# Altium project HW_RV_TOUCH_R1M1.PrjPcb (part 1 of 4)
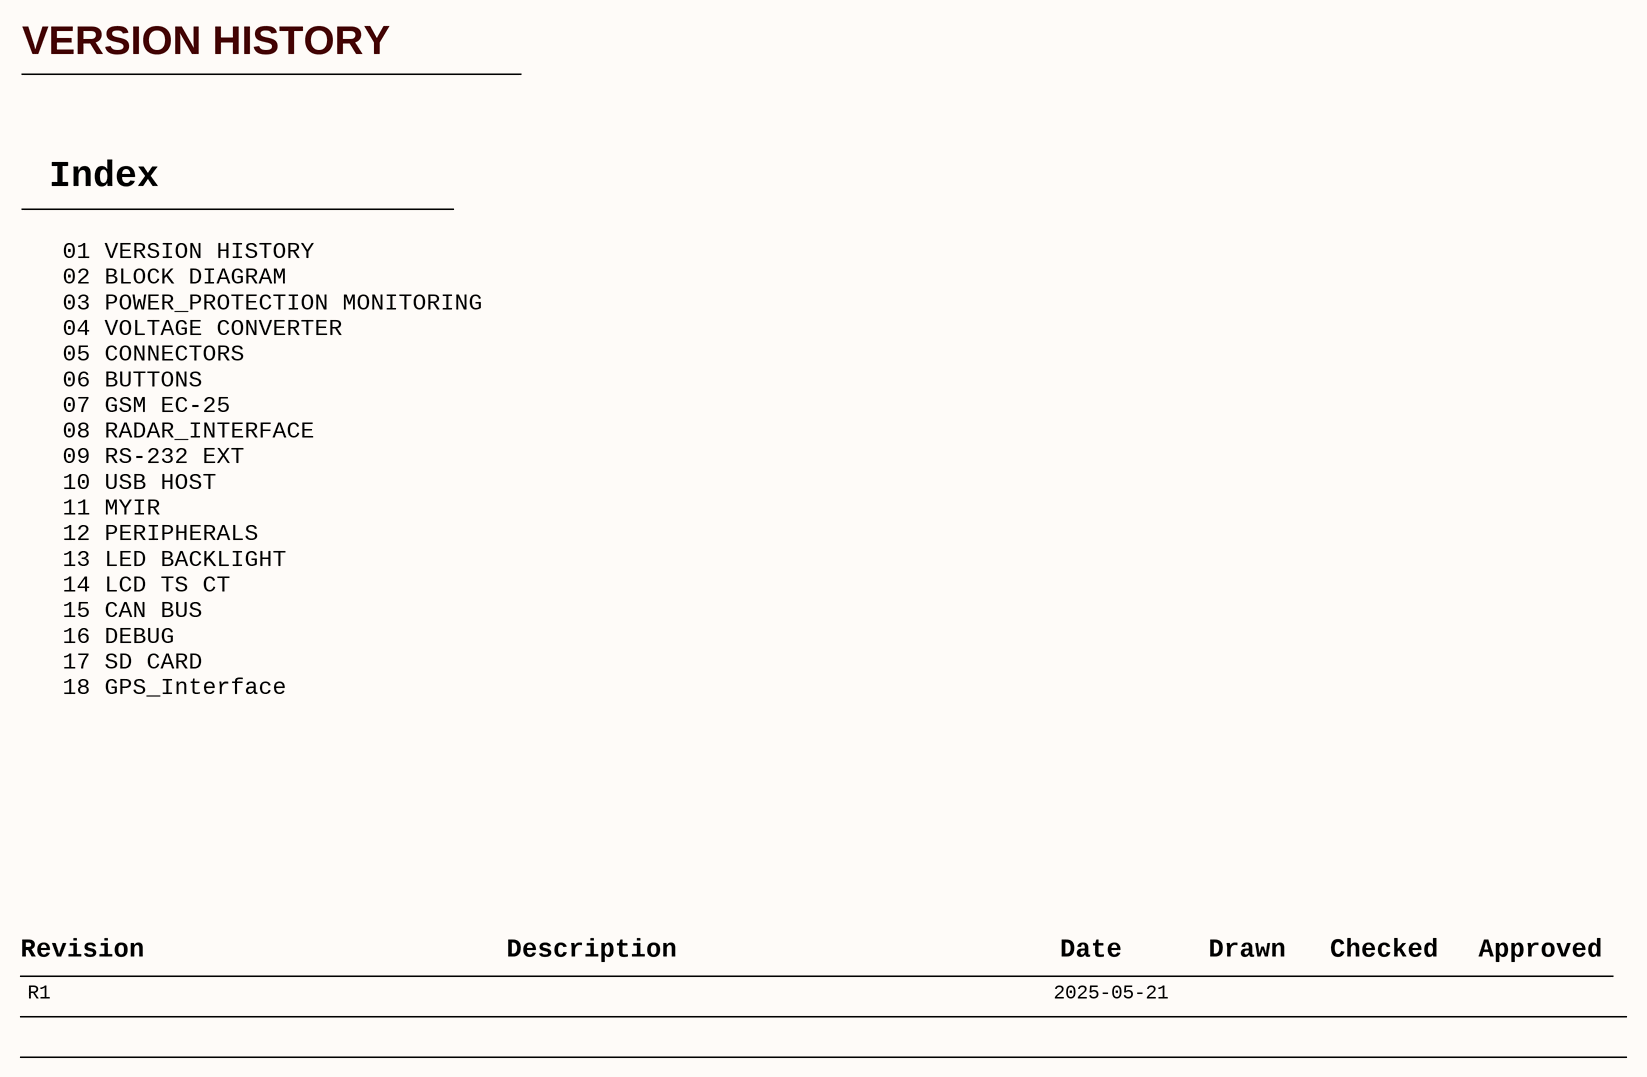
[diagram p0: 01_VERSION_HISTORY.SchDoc]
RevisionParameter: R1M1; TitleParameter: HW_RV_TOUCH
18 sheets, 341 parts. Net scope: flat (ports and power ports of the same name join across sheets).
Board file: HW_RV_TOUCH_R1M1.PcbDoc
Sheets:
  01_VERSION_HISTORY.SchDoc
  02_BLOCK_DIAGRAM.SchDoc
  03_POWER_PROTECTION_MONITORING.SchDoc
  04_VOLTAGE_CONVERTER.SchDoc
  05_CONNECTORS.SchDoc
  06_BUTTONS.SchDoc
  07_GSM_EM05.SchDoc
  08_RADAR_INTERFACE.SchDoc
  09_RS-232_EXT.SchDoc
  10_USB_HOST.SchDoc
  11_MYIR.SchDoc
  12_PERIPHERALS.SchDoc
  13_LED_BACKLIGHT.SchDoc
  14_LCD_TS_CT.SchDoc
  15_CAN_BUS.SchDoc
  16_DEBUG.SchDoc
  17_SD_CARD.SchDoc
  18_GPS_Interface.SchDoc

## Sheet 01_VERSION_HISTORY.SchDoc: =TitleParameter
size A3; Address: Crete IL; Organization: ASISGUARD; Address1: Kemalpasa, Kemalpasa Cd. No:290 D:292H, 35060 Bornova/Izmir/Turkey; Revision: R1M1

### Notes on the sheet
- VERSION HISTORY
- Index
- 01 VERSION HISTORY
  02 BLOCK DIAGRAM
  03 POWER_PROTECTION MONITORING
  04 VOLTAGE CONVERTER
  05 CONNECTORS
  06 BUTTONS
  07 GSM EC-25
  08 RADAR_INTERFACE
  09 RS-232 EXT
  10 USB HOST
  11 MYIR
  12 PERIPHERALS
  13 LED BACKLIGHT
  14 LCD TS CT
  15 CAN BUS
  16 DEBUG                                                                        17 SD CARD
  18 GPS_Interface
- Revision
- Description
- Date
- Drawn
- Checked
- Approved
- R1
- 2025-05-21
- Proje/Project:
- Sayfa Adı/Document Name:
- Çizilme Tarihi/Drawing Date
- Umit KAYACIK
- Tasarlayan/Designed By
- Sayfa/Sheet:
- Revision:
- of
- Son Güncelleme/Last Edit Date
- Kontrol eden/Checked By
- Onaylayan/Approved By
- Boyut/Size:
- Varyant/Variant:
- Dil/Language:
- A3
- ENG

## Sheet 02_BLOCK_DIAGRAM.SchDoc: =TitleParameter
size A3; Address: Crete IL; Organization: ASISGUARD; Address1: Kemalpasa, Kemalpasa Cd. No:290 D:292H, 35060 Bornova/Izmir/Turkey; Revision: R1M1
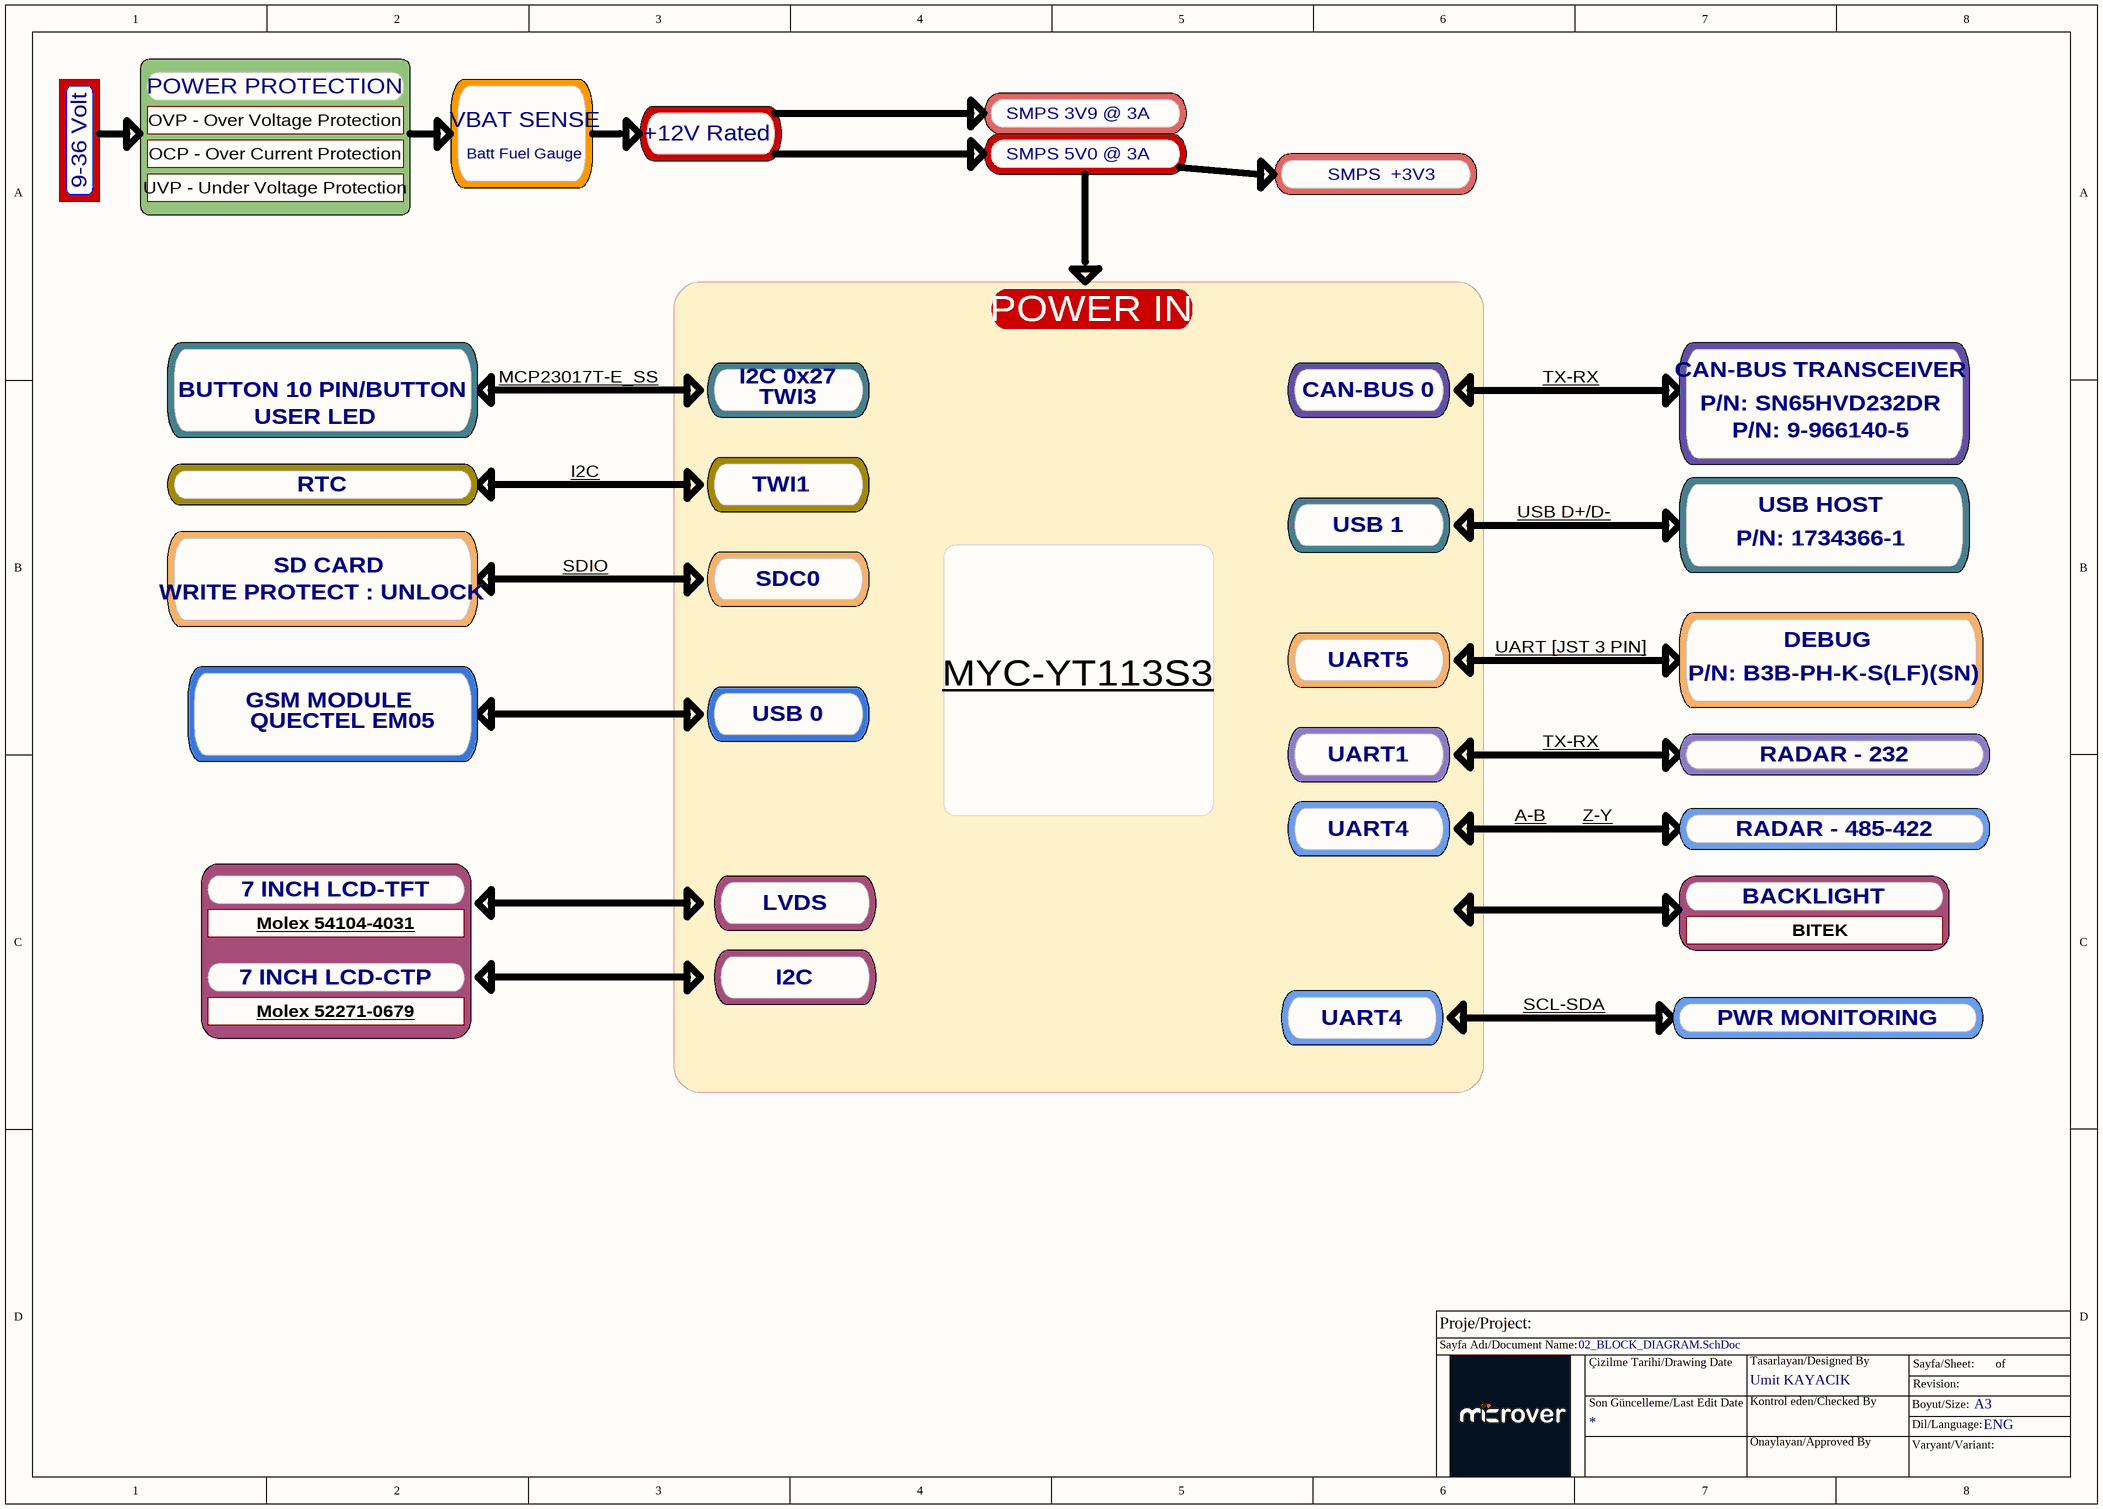
[diagram p1: 02_BLOCK_DIAGRAM.SchDoc]

### Notes on the sheet
- POWER PROTECTION
- SMPS 3V9 @ 3A
- 9-36 Volt
- OVP - Over Voltage Protection
- OCP - Over Current Protection
- UVP - Under Voltage Protection
- VBAT SENSE
- Batt Fuel Gauge
- +12V Rated
- SMPS 5V0 @ 3A
- SMPS  +3V3
- POWER IN
- MCP23017T-E_SS
- I2C 0x27
- TX-RX
- CAN-BUS TRANSCEIVER
- USER LED
- BUTTON 10 PIN/BUTTON
- TWI3
- CAN-BUS 0
- P/N: SN65HVD232DR
- P/N: 9-966140-5
- RTC
- I2C
- TWI1
- USB D+/D-
- USB HOST
- WRITE PROTECT : UNLOCK
- SD CARD
- SDIO
- SDC0
- USB 1
- P/N: 1734366-1
- UART [JST 3 PIN]
- DEBUG
- GSM MODULE
- QUECTEL EM05
- USB 0
- MYC-YT113S3 <https://www.myirtech.com/list.asp?id=722>
- UART5
- P/N: B3B-PH-K-S(LF)(SN)
- UART1
- RADAR - 232
- UART4
- A-B
- Z-Y
- RADAR - 485-422
- 7 INCH LCD-TFT
- Molex 54104-4031
- LVDS
- BACKLIGHT
- 7 INCH LCD-CTP
- BITEK
- Molex 52271-0679
- SCL-SDA
- PWR MONITORING
- Proje/Project:
- Sayfa Adı/Document Name:
- Çizilme Tarihi/Drawing Date
- Umit KAYACIK
- Tasarlayan/Designed By
- Sayfa/Sheet:
- Revision:
- of
- Son Güncelleme/Last Edit Date
- Kontrol eden/Checked By
- Onaylayan/Approved By
- Boyut/Size:
- Varyant/Variant:
- Dil/Language:
- A3
- ENG

## Sheet 03_POWER_PROTECTION_MONITORING.SchDoc: =TitleParameter
size A3; Address: Crete IL; Organization: ASISGUARD; Address1: Kemalpasa, Kemalpasa Cd. No:290 D:292H, 35060 Bornova/Izmir/Turkey; Revision: R1M1
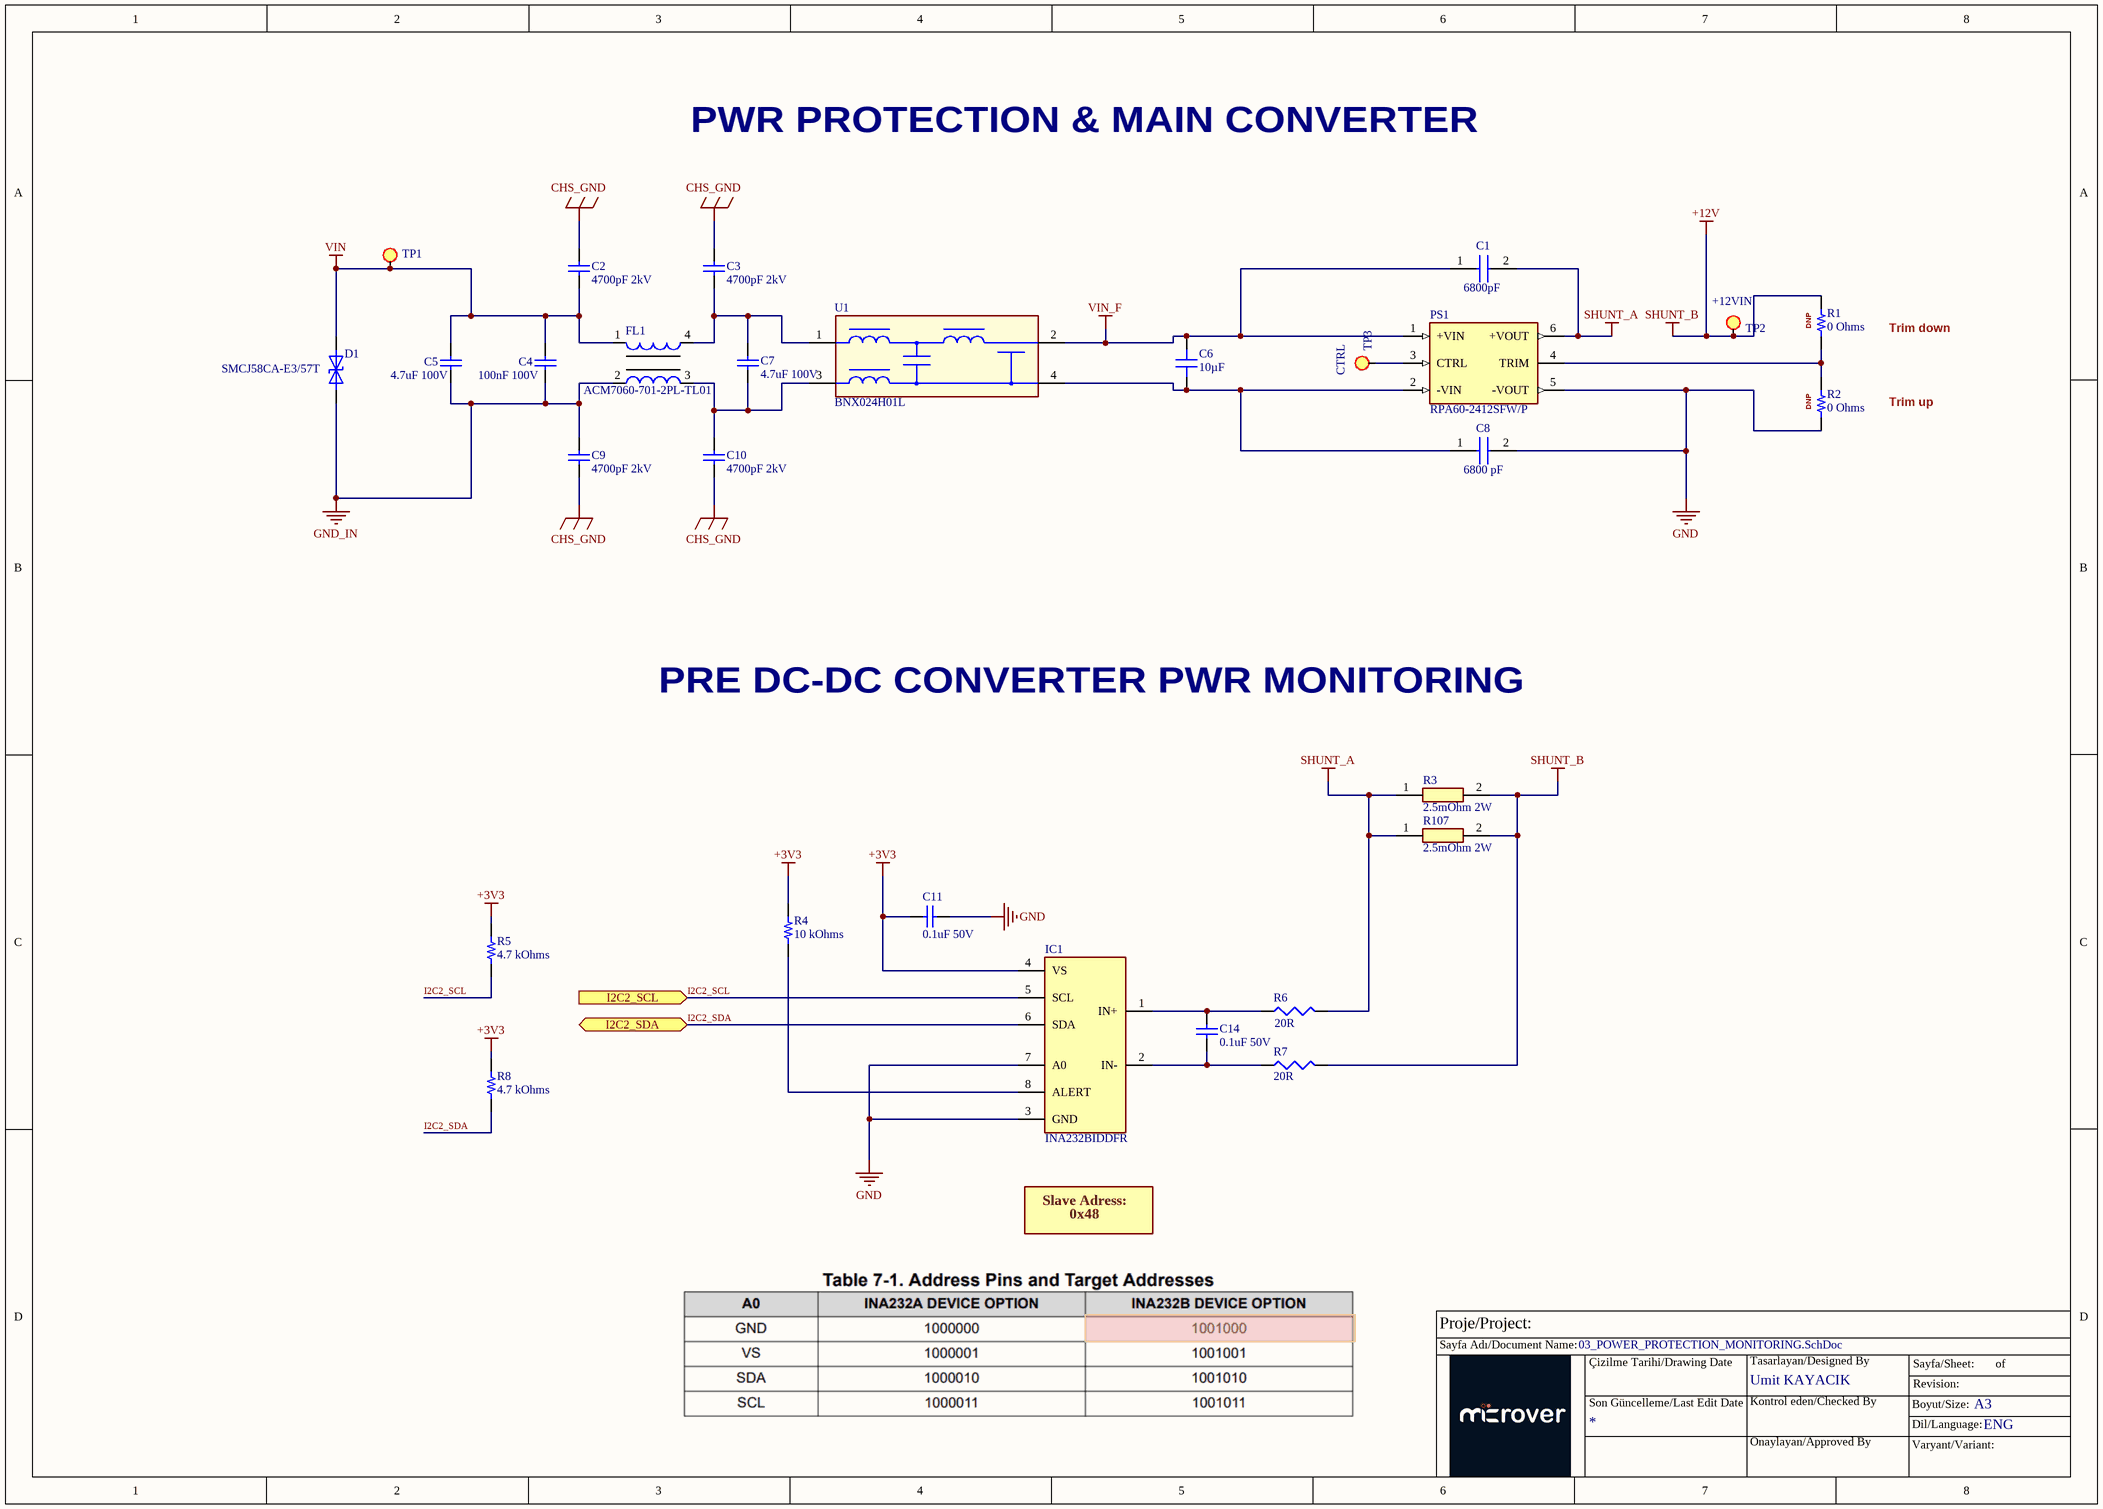
[diagram p2: 03_POWER_PROTECTION_MONITORING.SchDoc]

### Parts
C1  6800pF  [CAPC3225X280N]
C2  value 4700pF 2kV  [CAP1812]  (hidden comment: CAP CER 4700PF 2KV X7R 1812)
C3  value 4700pF 2kV  [CAP1812]  (hidden comment: CAP CER 4700PF 2KV X7R 1812)
C4  value 100nF 100V  [SMC0805]  (hidden comment: CAP CER 0.1UF 100V X7R 0805)
C5  value 4.7uF 100V  [CAP1210]  (hidden comment: CAP CER 4.7UF 100V X7S 1210)
C6  10µF  [CAP 1206_3216 - 1.8MM]
C7  value 4.7uF 100V  [CAP1210]  (hidden comment: CAP CER 4.7UF 100V X7S 1210)
C8  6800 pF  [CAPC3225X280N]
C9  value 4700pF 2kV  [CAP1812]  (hidden comment: CAP CER 4700PF 2KV X7R 1812)
C10  value 4700pF 2kV  [CAP1812]  (hidden comment: CAP CER 4700PF 2KV X7R 1812)
C11  value 0.1uF 50V  [SMC0603]  (hidden comment: CAP CER 0.1UF 50V X7R 0603)
C14  value 0.1uF 50V  [SMC0603]  (hidden comment: CAP CER 0.1UF 50V X7R 0603)
D1  SMCJ58CA-E3/57T  [DIOM7959X262N]
FL1  CMC 4A 2LN 700 OHM SMD  [TDK_0_MFG]  (value not drawn)
IC1  INA232BIDDFR  [SOT65P280X110-8N]
PS1  RPA60-2412SFW/P  [CONV_RPA60-2412SFW/P]
R1  0 Ohms  [RES 0402_1005]
R2  0 Ohms  [RES 0402_1005]
R3  2.5mOhm 2W  [RESC5125X89N]
R4  10 kOhms  [RES 0402_1005]
R5  4.7 kOhms  [RES 0603_1608]
R6  value 20R  [RES0603]  (hidden comment: RES 20 OHM 1% 1/10W 0603)
R7  value 20R  [RES0603]  (hidden comment: RES 20 OHM 1% 1/10W 0603)
R8  4.7 kOhms  [RES 0603_1608]
R107  2.5mOhm 2W  [RESC5125X89N]
TP1  VIN  [TEST_POINT_SMD]  (value not drawn)
TP2  +12VIN  [TEST_POINT_SMD]
TP3  CTRL  [TEST_POINT_SMD]
U1  FILTER LC 4.7UF SMD  [Murata_BNX02_MFG]  (value not drawn)

### Ports
I2C2_SCL (in), I2C2_SDA (bidir)

### Nets
+3V3: C11.1 IC1.4(VS) R4.2 R5.2 R8.2
+12V: R1.2 R3.2 R7.2 R107.2 TP2.1(TP)  [also labelled SHUNT_B]
CHS_GND: C2.2 C3.2 C9.1 C10.1
GND: C8.2 C11.2 IC1.3(GND) IC1.7(A0) PS1.5(-VOUT) R2.1
GND_IN: C4.1 C5.1 C9.2 D1.1 FL1.2
SHUNT_A: C1.2 PS1.6(+VOUT) R3.1 R6.2 R107.1
VIN: C2.1 C4.2 C5.2 D1.2 FL1.1 TP1.1(TP)
VIN_F: C1.1 C6.2 PS1.1(+VIN) U1.2(CB)
I2C2_SCL: IC1.5(SCL) R5.1 ; port I2C2_SCL
I2C2_SDA: IC1.6(SDA) R8.1 ; port I2C2_SDA
NetC3_1: C3.1 C7.2 FL1.4 U1.1(B)
NetC6_1: C6.1 C8.1 PS1.2(-VIN) U1.4(CG)
NetC7_1: C7.1 C10.2 FL1.3 U1.3(PSG)
NetC14_1: C14.1 IC1.2(IN-) R7.1
NetC14_2: C14.2 IC1.1(IN+) R6.1
NetIC1_8: IC1.8(ALERT) R4.1
NetPS1_3: PS1.3(CTRL) TP3.1(TP)
NetPS1_4: PS1.4(TRIM) R1.1 R2.2

### Notes on the sheet
- PWR PROTECTION & MAIN CONVERTER
- (near R1) DNP
- Trim down
- (near R2) DNP
- Trim up
- PRE DC-DC CONVERTER PWR MONITORING
- Slave Adress:
- 0x48
- Proje/Project:
- Sayfa Adı/Document Name:
- Çizilme Tarihi/Drawing Date
- Umit KAYACIK
- Tasarlayan/Designed By
- Sayfa/Sheet:
- Revision:
- of
- Son Güncelleme/Last Edit Date
- Kontrol eden/Checked By
- Onaylayan/Approved By
- Boyut/Size:
- Varyant/Variant:
- Dil/Language:
- A3
- ENG

### Library data of the parts
C1 = C1210C682MGRAC7800: CAP CER SMD 1210 6800PF 20% 2KV; Manufacturer_Name: KEMET; Datasheet Link: https://www.kemet.com/specsheet/C1210C682MGRACTU; Height: 2.8mm; Manufacturer_Part_Number: C1210C682MGRAC7800
C2 C3 C9 C10 = CAP1812_4700PF_2KV: 2kV 4.7nF X7R ±10% 1812 Multilayer Ceramic Capacitors MLCC - SMD/SMT ROHS; Manufacturer Part Number: 202S43W472KV4E; Order Code: *; Sirius Stock Code: *; LCSC Part Number: C167436; LCSC Manufacturer Part Number: 202S43W472KV4E
C4 = CAP0805_100nF_100V: 0.1 µF ±10% 100V Ceramic Capacitor X7R 0805 (2012 Metric); Manufacturer Part Number: CL21B104KCFNNNE; Order Code: DIGI : 1276-6840-1-ND; LCSC Manufacturer Part Number: CL21B104KCFNNNE; LCSC Part Number: C28233
C5 C7 = CAP1210_4.7UF_100V: 4.7 µF ±10% 100V Ceramic Capacitor X7S 1210 (3225 Metric); Manufacturer Part Number: CL32Y475KCIVPNE; Order Code: Digi: 1276-CL32Y475KCIVPNETR-ND; LCSC Manufacturer Part Number: CL32Y475KCIVPNE; LCSC Part Number: C2803397
C6 = 12065D106KAT2A: CAP CER 10UF 50V X5R 1206; manufacturer: AVX Corporation; Tolerance: ±10%; Part Number: 12065D106KAT2A; Value: 10µF; Applications: General Purpose; Capacitance: 10µF; componentlink1description: Datasheet; componentlink1url: http://datasheets.avx.com/cx5r.pdf; componentlink2description: DigiKey Link; componentlink2url: http://digikey.com/product-detail/en/avx-corporation/12065D106KAT2A/478-9979-1-ND/6149060; Device Package: 1206 (3216 Metric); lastupdated: 9/2/2020 1:05:35 AM; Lifecycle Status: Active; Minimum Order: 1; Mounting Type: Surface Mount, MLCC; Operating Temperature: -55°C ~ 85°C; Package / Case: 1206 (3216 Metric); packaging: TapeAndReel; partid: 21345; Part Status: Active; price: 0.16; series: -; Size / Dimension: 0.126" L x 0.063" W (3.20mm x 1.60mm); Supplier 1: DigiKey; Supplier Part Number 1: 478-9979-1-ND; Temperature Coefficient: X5R; Thickness (Max): 0.071" (1.80mm); Voltage - Rated: 50V
C8 = C1210C682MGRAC7800: Capacitor; Manufacturer_Name: KEMET; Datasheet Link: https://www.kemet.com/specsheet/C1210C682MGRACTU; Height: 2.8mm; Manufacturer_Part_Number: C1210C682MGRAC7800
C11 C14 = CAP0603_0.1UF_50V: 0.1 µF ±10% 50V Ceramic Capacitor X7R 0603 (1608 Metric); Manufacturer Part Number: CL10B104KB8NNNL; LCSC Manufacturer Part Number: CL10B104KB8NNNC; Order Code: DIGI:1276-CL10B104KB8NNNLTR-ND; Sirius Stock Code: A063-AGC10300001226; LCSC Part Number: C1591
D1 = SMCJ58CA-E3/57T: TransZorb 1500 W 58 V 93.6 Vcl Bi-Directional SMT TVS Diode - DO-214AB; Manufacturer: Vishay Semiconductors; Supplier 1: Digikey; Manufacturer Part Number: SMCJ58CA-E3/57T; RoHS: Yes; Category: TVS Diodes; Stock 1: 1611; Pricing 1: 1=0.64, 10=0.545, 100=0.3792 (USD); ComponentLink1URL: https://datasheet.ciiva.com/4247/smcj50a-4247736.pdf?src-supplier=Arrow+Electronics; ComponentLink1Description: https://datasheet.ciiva.com/4247/smcj50a-4247736.pdf?src-supplier=Arrow+Electronics; ComponentLink2URL: https://datasheet.ciiva.com/340/smcj50a-340997.pdf?src-supplier=Digikey; ComponentLink2Description: https://datasheet.ciiva.com/340/smcj50a-340997.pdf?src-supplier=Digikey; ComponentLink3URL: https://datasheet.ciiva.com/340/smcj50a-340998.pdf?src-supplier=Digikey; ComponentLink3Description: https://datasheet.ciiva.com/340/smcj50a-340998.pdf?src-supplier=Digikey; ComponentLink4URL: https://datasheet.ciiva.com/340/smcj50a-340999.pdf?src-supplier=Digikey; ComponentLink4Description: https://datasheet.ciiva.com/340/smcj50a-340999.pdf?src-supplier=Digikey; ComponentLink5URL: https://datasheet.ciiva.com/4508/smcj50a-241829-4508847.pdf?src-supplier=Mouser; ComponentLink5Description: https://datasheet.ciiva.com/4508/smcj50a-241829-4508847.pdf?src-supplier=Mouser; Supplier Part Number 1: SMCJ58CA-E3/57TGICT-ND
FL1 = ACM7060-701-2PL-TL01: 2 Line Common Mode Choke Surface Mount 700 Ohms @ 100 MHz 4A DCR 15mOhm; Order Code: Digi: 445-2215-2-ND; LCSC Manufacturer Part Number: ACM7060-701-2PL-TL01; LCSC Part Number: C78246; Manufacturer Part Number: ACM7060-701-2PL-TL01
IC1 = INA232BIDDFR: 48-V, 16-bit high-precision I²C output digital power monitor with alert 8-SOT-23-THIN -40 to 125; Manufacturer: Texas Instruments; Supplier 1: Digikey; Manufacturer Part Number: INA232BIDDFR; RoHS: No; Stock 1: 8755; Pricing 1: 1=2.5, 10=2.248, 25=2.1208, 100=1.8071, 250=1.6968, 500=1.4847, 1000=1.23018 (USD); Supplier Part Number 1: 296-INA232BIDDFRCT-ND
PS1 = RPA60-2412SFW/P: 60W DC/DC-Converter 'POWERLINE' 2 x1 1.5kV reg 4: ; V. In: 9-36; V. Out: 12; mA. Out: 5000; Manufacturer: Recom; Supplier 1: Digikey; Manufacturer Part Number: RPA60-2412SFW/P; RoHS: Yes; Category: Board Mount Modules; Stock 1: 3612; Pricing 1: 1=68.75, 5=66.14, 10=65.618, 25=63.5352, 50=60.4106, 100=56.2444 (USD); ComponentLink1URL: https://datasheet.octopart.com/RPA60-2412SFW-P-Recom-Power-datasheet-67314772.pdf?src-supplier=Newark; ComponentLink1Description: https://datasheet.octopart.com/RPA60-2412SFW-P-Recom-Power-datasheet-67314772.pdf?src-supplier=Newark; ComponentLink2URL: https://www.recom-power.com/pdf/Powerline-DC-DC/RPA60-FW.pdf?src-supplier=Digikey; ComponentLink2Description: https://www.recom-power.com/pdf/Powerline-DC-DC/RPA60-FW.pdf?src-supplier=Digikey; ComponentLink3URL: https://datasheet.octopart.com/RPA60-2412SFW-P-Recom-Power-datasheet-68305293.pdf?src-supplier=Sager+Electronics; ComponentLink3Description: https://datasheet.octopart.com/RPA60-2412SFW-P-Recom-Power-datasheet-68305293.pdf?src-supplier=Sager+Electronics; Supplier Part Number 1: 945-2958-ND
R1 R2 = HCJ0402ZT0R00: RES 0 OHM JUMPER 1/8W 0402; Manufacturer: Stackpole Electronics Inc; Power (Watts): 0.125W, 1/8W; Part Number: HCJ0402ZT0R00; Value: 0 Ohms; ComponentLink1Description: Datasheet; ComponentLink1URL: https://www.seielect.com/catalog/sei-hcj.pdf; ComponentLink2Description: DigiKey Link; ComponentLink2URL: https://www.digikey.com/en/products/detail/stackpole-electronics-inc/HCJ0402ZT0R00/4357659; Composition: Metal Foil; Device Package: 0402 (1005 Metric); Features: Automotive AEC-Q200; Height - Seated (Max): 0.018" (0.45mm); LastUpdated: 2/9/2024 8:29:49 PM; Lifecycle Status: Active; Minimum Order: 1; Number of Terminations: 2; Operating Temperature: -55°C ~ 155°C; Package / Case: 0402 (1005 Metric); Packaging: TapeAndReel; PartId: 12327; Part Status: Active; Price: 0.07; Ratings: AEC-Q200; Resistance: 0 Ohms; Series: HCJ; Size / Dimension: 0.039" L x 0.020" W (1.00mm x 0.50mm); Supplier 1: DigiKey; Supplier Part Number 1: HCJ0402ZT0R00CT-ND; Supplier Device Package: 0402; Tolerance: Jumper
R3 R107 = WSLP20102L500FEA: Resistor; Manufacturer_Name: Vishay; Datasheet Link: https://www.vishay.com/doc?30122; Height: 0.889mm; Manufacturer_Part_Number: WSLP20102L500FEA; Mouser Part Number: N/A; Mouser Price/Stock: https://www.mouser.co.uk/ProductDetail/Vishay-Dale/WSLP20102L500FEA?qs=%2FCXICPRLKg%252BjdjH3wDEueQ%3D%3D
R4 = RP73PF1E10KBTD: RES 10K OHM 0.1% 1/10W 0402; Manufacturer: TE Connectivity Passive Product; Power (Watts): 0.1W, 1/10W; Temperature Coefficient: ±25ppm/°C; Part Number: RP73PF1E10KBTD; Value: 10 kOhms; ComponentLink1Description: Datasheet; ComponentLink1URL: https://www.te.com/commerce/DocumentDelivery/DDEController?Action=srchrtrv&DocNm=1773272&DocType=DS&DocLang=English; ComponentLink2Description: DigiKey Link; ComponentLink2URL: https://www.digikey.com/en/products/detail/te-connectivity-passive-product/RP73PF1E10KBTD/8260957; Composition: Thin Film; Device Package: 0402 (1005 Metric); Height - Seated (Max): 0.014" (0.35mm); LastUpdated: 2/9/2024 8:30:24 PM; Lifecycle Status: Active; Minimum Order: 1; Number of Terminations: 2; Operating Temperature: -55°C ~ 155°C; Package / Case: 0402 (1005 Metric); Packaging: TapeAndReel; PartId: 2434; Part Status: Active; Price: 0.08; Resistance: 10 kOhms; Series: RP73, Holsworthy; Size / Dimension: 0.039" L x 0.020" W (1.00mm x 0.50mm); Supplier 1: DigiKey; Supplier Part Number 1: A127415CT-ND; Supplier Device Package: 0402; Tolerance: ±0.1%
R5 R8 = RN73R1JTTD4701B25: RES 4.7K OHM 0.1% 1/10W 0603; Manufacturer: KOA Speer Electronics, Inc.; Power (Watts): 0.1W, 1/10W; Temperature Coefficient: ±25ppm/°C; Part Number: RN73R1JTTD4701B25; Value: 4.7 kOhms; ComponentLink1Description: Datasheet; ComponentLink1URL: //media.digikey.com/pdf/Data%20Sheets/KOA%20Speer/RN73R_Type_DS.pdf; ComponentLink2Description: DigiKey Link; ComponentLink2URL: https://www.digikey.com/en/products/detail/koa-speer-electronics-inc/RN73R1JTTD4701B25/9991881; Composition: Thin Film; Device Package: 0603 (1608 Metric); Features: Automotive AEC-Q200, Moisture Resistant; Height - Seated (Max): 0.022" (0.55mm); LastUpdated: 2/9/2024 8:43:22 PM; Lifecycle Status: Active; Minimum Order: 1; Number of Terminations: 2; Operating Temperature: -55°C ~ 155°C; Package / Case: 0603 (1608 Metric); Packaging: TapeAndReel; PartId: 8410; Part Status: Active; Price: 0.05; Ratings: AEC-Q200; Resistance: 4.7 kOhms; Series: RN73R; Size / Dimension: 0.063" L x 0.031" W (1.60mm x 0.80mm); Supplier 1: DigiKey; Supplier Part Number 1: 2019-RN73R1JTTD4701B25CT-ND; Supplier Device Package: 0603; Tolerance: ±0.1%
R6 R7 = RES0603_20R_%1: 20 Ohms ±1% 0.1W, 1/10W Chip Resistor 0603 (1608 Metric) Automotive AEC-Q200 Thick Film; Manufacturer Part Number: RMCF0603FT20R0; LCSC Manufacturer Part Number: WR06X20R0FTL; Order Code: Digi: RMCF0603FT20R0TR-ND; Sirius Stock Code: *; LCSC Part Number: C163881
TP1-TP3 = TP: DESIG: testing PAD; FAB: NA; VAL: NOT POPULATED; PCB Footprint: test0_8-smd; REF: NA
U1 = BNX024H01L: LC EMI Filter 5th Order Low Pass 2 Channel C = 4.7µF 20 A 4-SMD, No Lead; Order Code: Digi: 490-7833-2-ND; LCSC Manufacturer Part Number: BNX024H01L; LCSC Part Number: C124739; Manufacturer Part Number: BNX024H01L

## Sheet 04_VOLTAGE_CONVERTER.SchDoc: =TitleParameter
size A3; Address: Crete IL; Organization: ASISGUARD; Address1: Kemalpasa, Kemalpasa Cd. No:290 D:292H, 35060 Bornova/Izmir/Turkey; Revision: R1M1
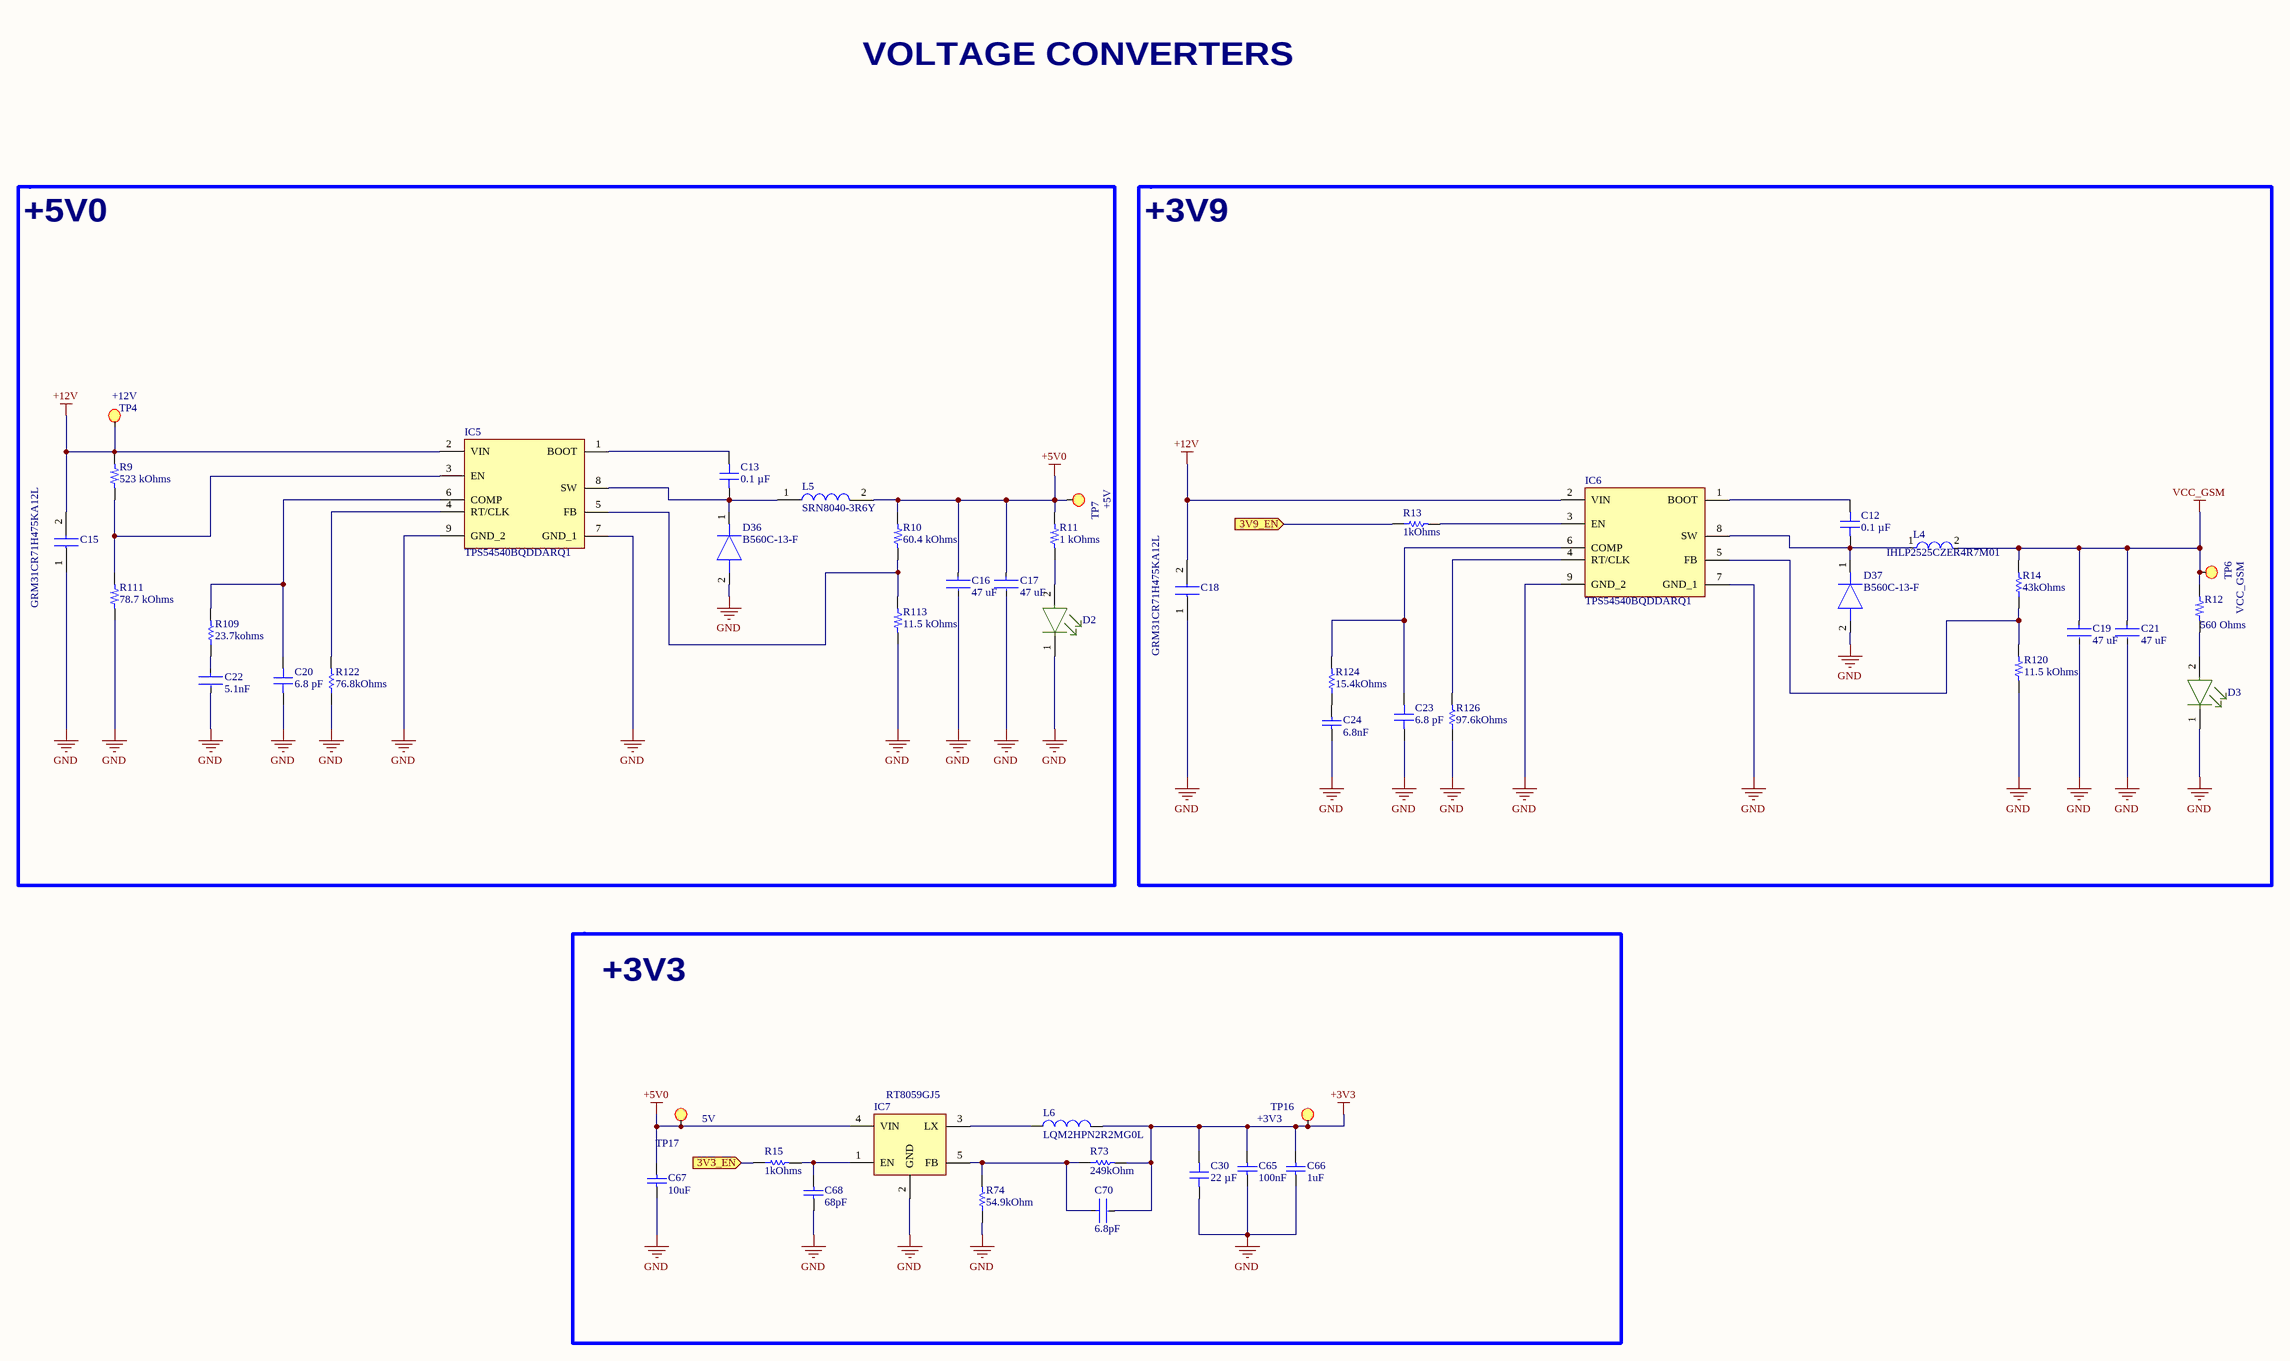
[diagram p3: 04_VOLTAGE_CONVERTER.SchDoc]

### Parts
C12  0.1 µF  [CAP0402(1005)X0.5]
C13  0.1 µF  [CAP0402(1005)X0.5]
C15  GRM31CR71H475KA12L  [CAPC3216X180N]
C16  47 uF  [FP-GRM32E-0_3-0_2-IPC_C]
C17  47 uF  [FP-GRM32E-0_3-0_2-IPC_C]
C18  GRM31CR71H475KA12L  [CAPC3216X180N]
C19  47 uF  [FP-GRM32E-0_3-0_2-IPC_C]
C20  6.8 pF  [CAP0603]
C21  47 uF  [FP-GRM32E-0_3-0_2-IPC_C]
C22  5.1nF  [FP-C0603C-CF-MFG]
C23  6.8 pF  [CAP0603]
C24  6.8nF  [CAPC1608X90X35NL10T15]
C30  22 µF  [CAP1206]
C65  100nF  [CAP0603]
C66  1uF  [CAP0603]
C67  10uF  [CAP0603]
C68  68pF  [CAP0603]
C70  6.8pF  [FP-C0603C-CF-MFG]
D2  LED GREEN CLEAR SMD  [Lite-On_GREEN_MFG]  (value not drawn)
D3  LED GREEN CLEAR SMD  [Lite-On_GREEN_MFG]  (value not drawn)
D36  B560C-13-F  [DIOM7959X250N]
D37  B560C-13-F  [DIOM7959X250N]
IC5  TPS54540BQDDARQ1  [SOIC127P600X170-9N]
IC6  TPS54540BQDDARQ1  [SOIC127P600X170-9N]
IC7  RT8059GJ5  [SOT94P280X100-5N]
L4  IHLP2525CZER4R7M01  [FP-IHLP-2525CZ-FP_2_413x3-MFG]
L5  SRN8040-3R6Y  [SRN8040-3R3Y]
L6  LQM2HPN2R2MG0L  [INDC2520X100N]
R9  523 kOhms  [RES0402(1005)]
R10  60.4 kOhms  [RES0402(1005)]
R11  1 kOhms  [RES 0603_1608]
R12  560 Ohms  [RES 0402_1005]
R13  1kOhms  [RESC1005X40X25LL05T10]
R14  43kOhms  [RESC1005X40X25NL05T05]
R15  1kOhms  [RESC1005X40X25LL05T10]
R73  249kOhm  [RESC1005X40X25NL05T05]
R74  54.9kOhm  [RESC1005X40X25LL05T10]
R109  23.7kohms  [RESC1005X40X25ML05T05]
R111  78.7 kOhms  [RES0402(1005)]
R113  11.5 kOhms  [RES0402(1005)]
R120  11.5 kOhms  [RES0402(1005)]
R122  76.8kOhms  [RESC1609X50X30ML10T20]
R124  15.4kOhms  [RESC1005X40X25ML05T05]
R126  97.6kOhms  [RESC1005X40X25ML05T10]
TP4  +12V  [TEST_POINT_SMD]
TP6  VCC_GSM  [TEST_POINT_SMD]
TP7  +5V  [TEST_POINT_SMD]
TP16  +3V3  [TEST_POINT_SMD]
TP17  5V  [TEST_POINT_SMD]

### Blocks framed on the sheet
+5V0: C13 C15-C17 C20 C22 D2 D36 IC5 L5 R9-R11 R109 R111 R113 R122 TP4 TP7
+3V9: C12 C18 C19 C21 C23 C24 D3 D37 IC6 L4 R12-R14 R120 R124 R126 TP6
+3V3: C30 C65-C68 C70 IC7 L6 R15 R73 R74 TP16 TP17

### Ports
3V3_EN (in), 3V9_EN (in)

### Nets
+3V3: C30.2 C65.2 C66.2 C70.2 L6.2 R73.2 TP16.1(TP)
+5V0: C16.1 C17.1 C67.1 IC7.4(VIN) L5.2 R10.2 R11.2 TP7.1(TP) TP17.1(TP)
+12V: C15.2 C18.2 IC5.2(VIN) IC6.2(VIN) R9.2 TP4.1(TP)
GND: C15.1 C16.2 C17.2 C18.1 C19.2 C20.1 C21.2 C22.2 C23.1 C24.1 C30.1 C65.1 C66.1 C67.2 C68.2 D2.1(C) D3.1(C) D36.2(A) D37.2(A) IC5.7(GND_1) IC5.9(GND_2) IC6.7(GND_1) IC6.9(GND_2) IC7.2(GND) R74.1 R111.1 R113.1 R120.1 R122.1 R126.1
VCC_GSM: C19.1 C21.1 L4.2 R12.2 R14.2 TP6.1(TP)
NetC12_1: C12.1 D37.1(K) IC6.8(SW) L4.1
NetC12_2: C12.2 IC6.1(BOOT)
NetC13_1: C13.1 D36.1(K) IC5.8(SW) L5.1
NetC13_2: C13.2 IC5.1(BOOT)
NetC20_2: C20.2 IC5.6(COMP) R109.2
NetC22_1: C22.1 R109.1
NetC23_2: C23.2 IC6.6(COMP) R124.2
NetC24_2: C24.2 R124.1
NetC68_1: C68.1 IC7.1(EN) R15.2
NetC70_1: C70.1 IC7.5(FB) R73.1 R74.2
NetD2_2: D2.2(A) R11.1
NetD3_2: D3.2(A) R12.1
NetIC5_3: IC5.3(EN) R9.1 R111.2
NetIC5_4: IC5.4(RT/CLK) R122.2
NetIC5_5: IC5.5(FB) R10.1 R113.2
NetIC6_3: IC6.3(EN) R13.2
NetIC6_4: IC6.4(RT/CLK) R126.2
NetIC6_5: IC6.5(FB) R14.1 R120.2
NetIC7_3: IC7.3(LX) L6.1
NetR13_1: R13.1 ; port 3V9_EN
NetR15_1: R15.1 ; port 3V3_EN

### Notes on the sheet
- VOLTAGE CONVERTERS
- Proje/Project:
- Sayfa Adı/Document Name:
- Çizilme Tarihi/Drawing Date
- Umit KAYACIK
- Tasarlayan/Designed By
- Sayfa/Sheet:
- Revision:
- of
- Son Güncelleme/Last Edit Date
- Kontrol eden/Checked By
- Onaylayan/Approved By
- Boyut/Size:
- Varyant/Variant:
- Dil/Language:
- A3
- ENG

### Library data of the parts
C12 C13 = C0402C104K4RECAUTO: CAP CER 0402 0.1UF 16V X7R 10%; manufacturer: KEMET; Part Number: C0402C104K4RECAUTO; Value: 0.1 µF; Applications: Automotive, ESD Protection; Capacitance: 0.1 µF; componentlink1description: Datasheet; componentlink1url: https://api.kemet.com/component-edge/download/datasheet/C0402C104K4RECAUTO.pdf; componentlink2description: DigiKey Link; componentlink2url: https://www.digikey.com/en/products/detail/kemet/C0402C104K4RECAUTO/8563695; Device Package: 0402 (1005 Metric); lastupdated: 2/9/2024 8:04:38 PM; Lifecycle Status: Active; Minimum Order: 1; Mounting Type: Surface Mount, MLCC; Operating Temperature: -55°C ~ 125°C; Package / Case: 0402 (1005 Metric); packaging: TapeAndReel; partid: 1731; Part Status: Active; price: 0.01; Ratings: AEC-Q200; series: ESD SMD Auto X7R; Size / Dimension: 0.039" L x 0.020" W (1.00mm x 0.50mm); Supplier 1: DigiKey; Supplier Part Number 1: 399-17167-1-ND; Temperature Coefficient: X7R; Thickness (Max): 0.022" (0.55mm); Tolerance: ±10%; Voltage - Rated: 16V
C15 C18 = GRM31CR71H475KA12L: Capacitor; Manufacturer_Name: Murata Electronics; Datasheet Link: https://search.murata.co.jp/Ceramy/image/img/A01X/G101/ENG/GRM31CR71H475KA12-01A.pdf; Height: 1.8mm; Manufacturer_Part_Number: GRM31CR71H475KA12L; Mouser Part Number: 81-GRM31CR71H475KA2L; Mouser Price/Stock: https://www.mouser.co.uk/ProductDetail/Murata-Electronics/GRM31CR71H475KA12L?qs=QOxk%252BkhTc6I%252BVQUsJuOHog%3D%3D; Arrow Part Number: GRM31CR71H475KA12L; Arrow Price/Stock: https://www.arrow.com/en/products/grm31cr71h475ka12l/murata-manufacturing?utm_currency=USD&region=nac
C16 C17 C19 C21 = CMP-2000-06362-2: CAP CER 47UF 16V X5R 1210; Part Number: GRM32ER61C476KE15L; Tolerance: 10%; Material: Ceramic; Case Code (Metric): 3225; RoHS Compliant: Yes; Min Operating Temperature: -55°C; Radiation Hardening: No; Voltage: 16V; Package Quantity: 1; Case Code (Imperial): 1210; REACH SVHC: No SVHC; Capacitance: 47uF; Voltage Rating (DC): 16V; Dielectric: X5R; Case/Package: 1210; Length: 3.2mm; Voltage Rating: 16V; Packaging: Cut Tape; Width: 0.098inch; Number of Pins: 2; Lead Free: Lead Free; Height: 2.5mm; Mount: Surface Mount; Termination: SMD/SMT; Max Operating Temperature: 85°C; Thickness: 0.106inch; Depth: 2.5mm
C20 C23 = 06031U6R8BAT2A: CAP CER 6.8PF 100V NP0 0603; manufacturer: KYOCERA AVX; Temperature Coefficient: C0G, NP0; Tolerance: ±0.1pF; Part Number: 06031U6R8BAT2A; Value: 6.8 pF; Applications: RF, Microwave, High Frequency; Capacitance: 6.8 pF; componentlink1description: Datasheet; componentlink1url: https://datasheets.kyocera-avx.com/U-Series.pdf; componentlink2description: DigiKey Link; componentlink2url: https://www.digikey.com/en/products/detail/kyocera-avx/06031U6R8BAT2A/1598953; Device Package: 0603 (1608 Metric); Features: Ultra Low ESR; lastupdated: 2/9/2024 8:09:59 PM; Lifecycle Status: Active; Minimum Order: 1; Mounting Type: Surface Mount, MLCC; Operating Temperature: -55°C ~ 125°C; Package / Case: 0603 (1608 Metric); packaging: TapeAndReel; partid: 35837; Part Status: Active; price: 0.05; series: U; Size / Dimension: 0.060" L x 0.030" W (1.52mm x 0.76mm); Supplier 1: DigiKey; Supplier Part Number 1: 478-06031U6R8BAT2ACT-ND; Thickness (Max): 0.036" (0.91mm); Voltage - Rated: 100V
C22 = CMP-1035-02216-3: CAP CER 5100PF 50V C0G/NP0 0603; Manufacturer: KEMET; Manufacturer Part Number: C0603C512J5GACTU; Tolerance: 0.05; Material: Ceramic; Value: 5,100 pF; Temperature Characteristic: C0G; Temperature Coefficient: 30ppm/°C; Automotive Grade: Grade 1; Mouser Description: Multilayer Ceramic Capacitors MLCC - SMD/SMT 50volts 5100pF 5% C0G; Lead Free: Yes; Digikey Description: CAP CER 5100PF 50V C0G/NP0 0603; ComponentLink2URL: https://api.kemet.com/component-edge/download/datasheet/C0603C100J5GACAUTO.pdf; Octopart: https://octopart.com/c0603c512j5gactu-kemet-19757382; Device Class L2: Capacitors; Automotive: Yes; ComponentLink2Description: Datasheet; Voltage Rating: 50 V; Temperature Range High: +125°C; Temperature Range Low: -55°C; RoHS: TRUE; Capacitance: 5,100 pF; Temperature: -55°C to +125°C; Package: C0603C-CF; Device Class L1: Passive Components; Height: 0.87mm; Device Class L3: Ceramic Capacitors; Category: Cap; Part Number: C0603C512J5GACTU
C24 = CMP-2006-02958-1: Part Number: GRM188R72A682KA01D; Manufacturer: Murata
C30 = CL31A226KAHNNNE: CAP CER 22UF 25V X5R 1206; manufacturer: Samsung Electro-Mechanics; Tolerance: ±10%; Part Number: CL31A226KAHNNNE; Value: 22 µF; Applications: General Purpose; Capacitance: 22 µF; componentlink1description: Datasheet; componentlink1url: http://www.samsungsem.com/kr/support/product-search/mlcc/CL31A226KAHNNNE.jsp; componentlink2description: DigiKey Link; componentlink2url: https://www.digikey.com/en/products/detail/samsung-electro-mechanics/CL31A226KAHNNNE/3888705; Device Package: 1206 (3216 Metric); lastupdated: 3/11/2024 7:11:00 AM; Lifecycle Status: Active; Minimum Order: 1; Mounting Type: Surface Mount, MLCC; Operating Temperature: -55°C ~ 85°C; Package / Case: 1206 (3216 Metric); packaging: TapeAndReel; partid: 22185; Part Status: Active; price: 0.07; series: CL; Size / Dimension: 0.126" L x 0.063" W (3.20mm x 1.60mm); Supplier 1: DigiKey; Supplier Part Number 1: 1276-3047-1-ND; Temperature Coefficient: X5R; Thickness (Max): 0.071" (1.80mm); Voltage - Rated: 25V
C65 = CAP0603_100nF: CAP CER 0.1UF 50V X7R 0603; Part Number: C0603C104K5RACTU; Value: 100nF 50V; Order Code: DIGI : 399-5089-1-ND
C66 = CAP0603_100nF: CAP CER 1uF 25V X7R 0603; Part Number: CGA3E1X7R1E105K080AE; Value: 1uF 25V; Order Code: DIGI : 445-173628-2-ND
C67 = CAP0603_100nF: Ceramic Capacitor,10uF,16V,+/-20%,X5R,0603,Samsung; P/N: CL10A106MONQNC; Value: 10uF 16V
C68 = CAP0603_100nF: 68 pF ±2% 50V Ceramic Capacitor C0G, NP0 0603 (1608 Metric); Part Number: 06035A680GAT2A; Value: 68pF 50V; Order Code: DIGI : 478-10332-2-ND
C70 = CMP-2006-03271-2: CAP CER 6.8PF 50V NP0 0603; Manufacturer Part Number: C0603C689C5GACTU; Manufacturer: KEMET; Automotive Grade: Grade 1; Temperature Coefficient: 30ppm/°C; Temperature Characteristic: C0G; Tolerance: 0.25 pF; Material: Ceramic; ComponentLink2URL: https://api.kemet.com/component-edge/download/datasheet/C0603C100J5GACAUTO.pdf; Mouser Description: 0603 C 6.8pF Ceramic Multilayer Capacitor; 50V dc; +125C; C0G Dielectric; +/-0.25pF; Temperature Range High: +125°C; Device Class L1: Passive Components; Temperature: -55°C to +125°C; Digikey Description: CAP CER 6.8PF 50V NP0 0603; Device Class L2: Capacitors; Automotive: Yes; Octopart: https://octopart.com/c0603c689c5gactu-kemet-8718591; Category: Cap; ComponentLink2Description: Datasheet; RoHS: TRUE; Capacitance: 6.8 pF; Value: 6.8 pF; Lead Free: Yes; Device Class L3: Ceramic Capacitors; Package: C0603C-CF; Voltage Rating: 50 V; Temperature Range Low: -55°C; Height: 0.87mm; Part Number: C0603C689C5GACTU
D2 D3 = LTST-C191KGKT: Green 571nm LED Indication - Discrete 2V 0603 (1608 Metric); Manufacturer Part Number: 150060VS75000; Order Code: 150060VS75000; LCSC Manufacturer Part Number: 150060VS75000; LCSC Part Number: 150060VS75000
D36 D37 = B560C-13-F: Manufacturer_Name: Diodes Incorporated; Datasheet Link: https://datasheet.lcsc.com/szlcsc/Diodes-Incorporated-B560C-13-F_C85100.pdf; Height: 2.5mm; Manufacturer_Part_Number: B560C-13-F; Mouser Part Number: 621-B560C-F; Mouser Price/Stock: https://www.mouser.co.uk/ProductDetail/Diodes-Incorporated/B560C-13-F?qs=OC0R%252Bhozcm%252BAsjMXklZLIw%3D%3D; Arrow Part Number: B560C-13-F; Arrow Price/Stock: https://www.arrow.com/en/products/b560c-13-f/diodes-incorporated?utm_currency=USD&region=nac
IC5 IC6 = TPS54540BQDDARQ1: Integrated Circuit; Manufacturer_Name: Texas Instruments; Datasheet Link: http://www.ti.com/lit/gpn/tps54540b-q1; Height: 1.7mm; Manufacturer_Part_Number: TPS54540BQDDARQ1; Mouser Part Number: 595-TPS54540BQDDARQ1; Mouser Price/Stock: https://www.mouser.co.uk/ProductDetail/Texas-Instruments/TPS54540BQDDARQ1?qs=Mv7BduZupUh5p%252BrvdCEqBg%3D%3D; Arrow Part Number: TPS54540BQDDARQ1; Arrow Price/Stock: https://www.arrow.com/en/products/tps54540bqddarq1/texas-instruments?utm_currency=USD&region=nac
IC7 = RT8059GJ5: Integrated Circuit; Manufacturer_Name: RICHTEK; Datasheet Link: http://www.farnell.com/datasheets/1756324.pdf; Height: 1mm; Manufacturer_Part_Number: RT8059GJ5
L4 = CMP-02424-000538-1: Commercial Inductors, High Saturation Series 4.7uH 5.5A 40mΩ 20%; DC Resistance (DCR): 40mR; Max DC Current: 10A; Shielding: Shielded; Test Frequency: 100kHz; Self Resonant Frequency: 5MHz; Core Material: Metal; Height: 3mm; Depth: 6.72mm; Inductance Tolerance: 20%; Inductance: 4.7uH; Number of Pins: 2; Military Standard: Not; Min Operating Temperature: -55°C; Mount: Surface Mount; Saturation Current: 10A; Case/Package: 2525; Case Code (Metric): 6363; Packaging: Tape and Reel; Width: 0.255inch; Current Rating: 5.5A; Package Quantity: 2000; Termination: SMD/SMT; Case Code (Imperial): 2525; Lead Free: Lead Free; Contact Plating: Tin; Max Operating Temperature: 125°C; Tolerance: 20%; Length: 7.24mm; Radiation Hardening: No; Height - Seated (Max): 0.118inch; RMS Current (Irms): 5.5A
L5 = SRN8040-3R3Y: Inductor; Manufacturer_Name: Bourns; Datasheet Link: http://www.bourns.com/data/global/pdfs/SRN8040.pdf; Manufacturer_Part_Number: SRN8040-3R6Y; Mouser Part Number: SRN8040-3R6Y
L6 = LQM2HPN2R2MG0L: Inductor Power Chip Shielded Multi-Layer 2.2uH 20% 1MHz Ferrite 1.3A 100mOhm DCR 1008 T/R
R9 = CRCW0402523KFKED: RES SMD 523K OHM 1% 1/16W 0402; Manufacturer: Vishay Dale; Power (Watts): 0.063W, 1/16W; Temperature Coefficient: ±100ppm/°C; Part Number: CRCW0402523KFKED; Value: 523 kOhms; ComponentLink1Description: Datasheet; ComponentLink1URL: http://www.vishay.com/docs/20035/dcrcwe3.pdf; ComponentLink2Description: DigiKey Link; ComponentLink2URL: https://www.digikey.com/en/products/detail/vishay-dale/CRCW0402523KFKED/1178317; Composition: Thick Film; Device Package: 0402 (1005 Metric); Features: Automotive AEC-Q200; Height - Seated (Max): 0.016" (0.40mm); LastUpdated: 2/9/2024 8:29:43 PM; Lifecycle Status: Active; Minimum Order: 1; Number of Terminations: 2; Operating Temperature: -55°C ~ 155°C; Package / Case: 0402 (1005 Metric); Packaging: TapeAndReel; PartId: 14531; Part Status: Active; Price: 0.01; Ratings: AEC-Q200; Resistance: 523 kOhms; Series: CRCW; Size / Dimension: 0.039" L x 0.020" W (1.00mm x 0.50mm); Supplier 1: DigiKey; Supplier Part Number 1: 541-523KLCT-ND; Supplier Device Package: 0402; Tolerance: ±1%
R10 = CRCW040260K4FKED: RES SMD 60.4K OHM 1% 1/16W 0402; Manufacturer: Vishay Dale; Power (Watts): 0.063W, 1/16W; Temperature Coefficient: ±100ppm/°C; Part Number: CRCW040260K4FKED; Value: 60.4 kOhms; ComponentLink1Description: Datasheet; ComponentLink1URL: http://www.vishay.com/docs/20035/dcrcwe3.pdf; ComponentLink2Description: DigiKey Link; ComponentLink2URL: https://www.digikey.com/en/products/detail/vishay-dale/CRCW040260K4FKED/1178210; Composition: Thick Film; Device Package: 0402 (1005 Metric); Features: Automotive AEC-Q200; Height - Seated (Max): 0.016" (0.40mm); LastUpdated: 2/9/2024 8:29:40 PM; Lifecycle Status: Active; Minimum Order: 1; Number of Terminations: 2; Operating Temperature: -55°C ~ 155°C; Package / Case: 0402 (1005 Metric); Packaging: CutTape; PartId: 15537; Part Status: Active; Price: 0.01; Ratings: AEC-Q200; Resistance: 60.4 kOhms; Series: CRCW; Size / Dimension: 0.039" L x 0.020" W (1.00mm x 0.50mm); Supplier 1: DigiKey; Supplier Part Number 1: 541-60.4KLCT-ND; Supplier Device Package: 0402; Tolerance: ±1%
R11 = RNCP0603FTD1K00: RES 1K OHM 1% 1/8W 0603; Manufacturer: Stackpole Electronics Inc; Power (Watts): 0.125W, 1/8W; Temperature Coefficient: ±100ppm/°C; Part Number: RNCP0603FTD1K00; Value: 1 kOhms; ComponentLink1Description: Datasheet; ComponentLink1URL: https://www.seielect.com/catalog/sei-rncp.pdf; ComponentLink2Description: DigiKey Link; ComponentLink2URL: https://www.digikey.com/en/products/detail/stackpole-electronics-inc/RNCP0603FTD1K00/2240106; Composition: Thin Film; Device Package: 0603 (1608 Metric); Features: Anti-Sulfur; Height - Seated (Max): 0.022" (0.55mm); LastUpdated: 2/9/2024 8:43:33 PM; Lifecycle Status: Active; Minimum Order: 1; Number of Terminations: 2; Operating Temperature: -55°C ~ 155°C; Package / Case: 0603 (1608 Metric); Packaging: TapeAndReel; PartId: 5694; Part Status: Active; Price: 0.01; Resistance: 1 kOhms; Series: RNCP; Size / Dimension: 0.061" L x 0.031" W (1.55mm x 0.80mm); Supplier 1: DigiKey; Supplier Part Number 1: RNCP0603FTD1K00CT-ND; Supplier Device Package: 0603; Tolerance: ±1%
R12 = ESR01MZPF5600: ANTI-SURGE CHIP RESISTORS; Part Number: ESR01MZPF5600; Value: 560 Ohms
R13 R15 = CMP-2002-03045-1: Part Number: CRCW04021K00FKEDHP; Manufacturer: Vishay Dale
R14 = CMP-2002-00002-1: Part Number: CRCW040243K0FKED; Manufacturer: Vishay Dale
R73 = CMP-2002-08401-1: Part Number: CRCW0402249KFKED; Manufacturer: Vishay Dale
R74 = CMP-2002-07133-1: Part Number: RC0402FR-0754K9L; Manufacturer: Yageo / Phycomp
R109 = CMP-1011-00663-2: RES SMD 23.7K OHM 1% 1/16W 0402; Part Number: CRCW040223K7FKED; Manufacturer: Vishay Dale
R111 = CRCW040290K9FKED: RES SMD 78.7K OHM 1% 1/16W 0402; Part Number: CRCW040278K7FKED; Power (Watts): 0.063W, 1/16W; Resistance: 90.9 kOhms; Temperature Coefficient: ±100ppm/°C; Value: 78.7 kOhms; Composition: Thick Film; Device Package: 0402 (1005 Metric); Height - Seated (Max): 0.016" (0.40mm); LastUpdated: 2/9/2024 8:29:54 PM; Lifecycle Status: Active; Minimum Order: 1; Number of Terminations: 2; Operating Temperature: -55°C ~ 155°C; Package / Case: 0402 (1005 Metric); Packaging: TapeAndReel; Part Status: Active; Price: 0.01; Series: CRCW; Size / Dimension: 0.039" L x 0.020" W (1.00mm x 0.50mm); Supplier Device Package: 0402; Tolerance: ±1%
R113 R120 = CRCW040211K5FKED: RES SMD 11.5K OHM 1% 1/16W 0402; Manufacturer: Vishay Dale; Power (Watts): 0.063W, 1/16W; Temperature Coefficient: ±100ppm/°C; Part Number: CRCW040211K5FKED; Value: 11.5 kOhms; ComponentLink1Description: Datasheet; ComponentLink1URL: http://www.vishay.com/docs/20035/dcrcwe3.pdf; ComponentLink2Description: DigiKey Link; ComponentLink2URL: https://www.digikey.com/en/products/detail/vishay-dale/CRCW040211K5FKED/1178127; Composition: Thick Film; Device Package: 0402 (1005 Metric); Features: Automotive AEC-Q200; Height - Seated (Max): 0.016" (0.40mm); LastUpdated: 7/12/2023 7:23:57 PM; Lifecycle Status: Active; Minimum Order: 1; Number of Terminations: 2; Operating Temperature: -55°C ~ 155°C; Package / Case: 0402 (1005 Metric); Packaging: CutTape; PartId: 10330; Part Status: Active; Price: 0.01; Ratings: AEC-Q200; Resistance: 11.5 kOhms; Series: CRCW; Size / Dimension: 0.039" L x 0.020" W (1.00mm x 0.50mm); Supplier 1: DigiKey; Supplier Part Number 1: 541-11.5KLCT-ND; Supplier Device Package: 0402; Tolerance: ±1%
R122 = CMP-1012-00723-2: Part Number: CRCW060376K8FKEA; Manufacturer: Vishay Dale
R124 = CMP-2002-08222-1: Manufacturer: Vishay Dale; Part Number: CRCW040215K4FKED
R126 = CMP-2002-07845-1: Manufacturer: Yageo; Part Number: RC0402FR-0797K6L
TP4 TP6 TP7 TP16 TP17 = TP: as TP1 on sheet 03_POWER_PROTECTION_MONITORING; REF: NA

## Sheet 05_CONNECTORS.SchDoc: =TitleParameter
size A3; Address: Crete IL; Organization: ASISGUARD; Address1: Kemalpasa, Kemalpasa Cd. No:290 D:292H, 35060 Bornova/Izmir/Turkey; Revision: R1M1
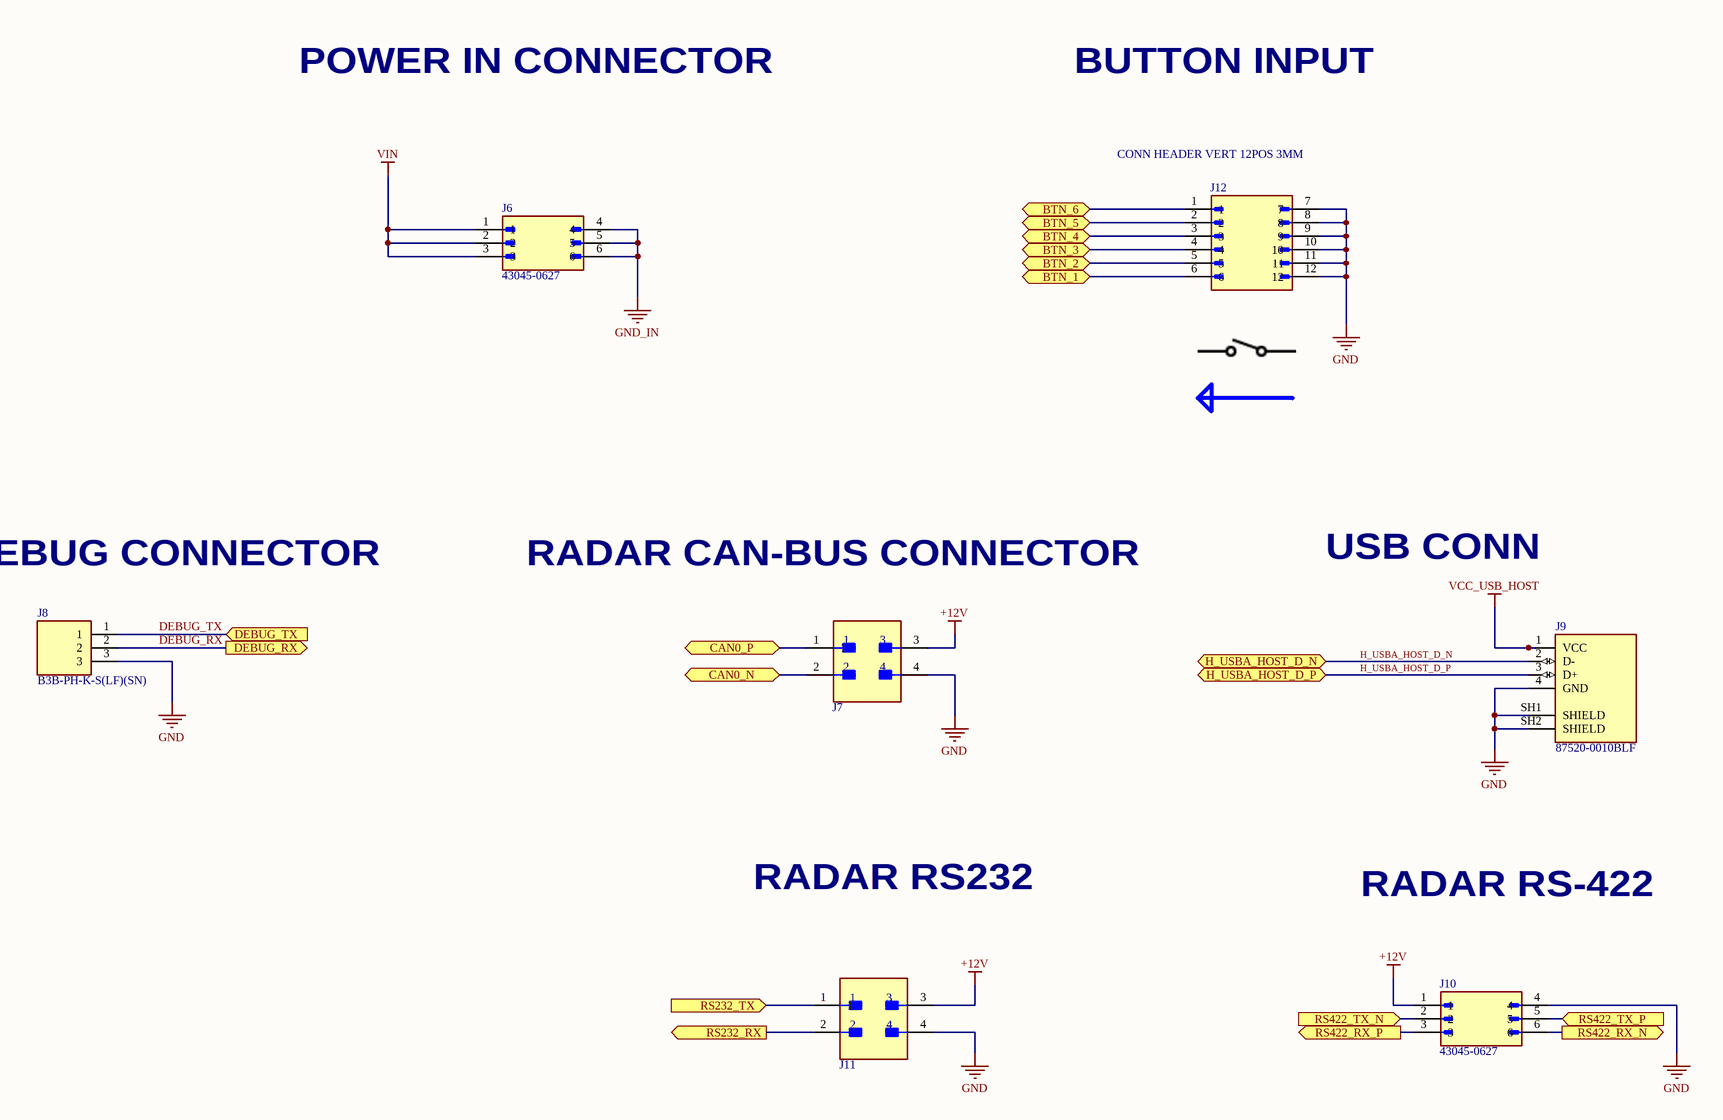
[diagram p4: 05_CONNECTORS.SchDoc]

### Parts
J6  43045-0627  [MOLEX_430450627]
J7  0430450427  [MicroFit_2x2_VERT]  (value not drawn)
J8  B3B-PH-K-S(LF)(SN)  [SHDR3W50P0X200_1X3_790X450X600P]
J9  87520-0010BLF  [AMPHENOL_87520-0010BLF]
J10  43045-0627  [MOLEX_430450627]
J11  0430450427  [MicroFit_2x2_VERT]  (value not drawn)
J12  CONN HEADER VERT 12POS 3MM  [MOLEX_430451227]

### Ports
BTN_1 (bidir), BTN_2 (bidir), BTN_3 (bidir), BTN_4 (bidir), BTN_5 (bidir), BTN_6 (bidir), CAN0_N (bidir), CAN0_P (bidir), DEBUG_RX (out), DEBUG_TX (in), H_USBA_HOST_D_N (bidir), H_USBA_HOST_D_P (bidir), RS232_RX (out), RS232_TX (in), RS422_RX_N (out), RS422_RX_P (out), RS422_TX_N (in), RS422_TX_P (in)

### Nets
+12V: J7.3 J10.1 J11.3
GND: J7.4 J8.3 J9.4(GND) J9.SH1(SHIELD) J9.SH2(SHIELD) J10.4 J11.4 J12.7 J12.8 J12.9 J12.10 J12.11 J12.12
GND_IN: J6.4 J6.5 J6.6
VCC_USB_HOST: J9.1(VCC)
VIN: J6.1 J6.2 J6.3
CAN0_N: J7.2 ; port CAN0_N
CAN0_P: J7.1 ; port CAN0_P
DEBUG_RX: J8.2 ; port DEBUG_RX
DEBUG_TX: J8.1 ; port DEBUG_TX
H_USBA_HOST_D_N: J9.2(D-) ; port H_USBA_HOST_D_N
H_USBA_HOST_D_P: J9.3(D+) ; port H_USBA_HOST_D_P
RS232_RX: J11.2 ; port RS232_RX
RS232_TX: J11.1 ; port RS232_TX
RS422_RX_N: J10.6 ; port RS422_RX_N
RS422_RX_P: J10.3 ; port RS422_RX_P
RS422_TX_N: J10.2 ; port RS422_TX_N
RS422_TX_P: J10.5 ; port RS422_TX_P
NetJ12_1: J12.1 ; port BTN_6
NetJ12_2: J12.2 ; port BTN_5
NetJ12_3: J12.3 ; port BTN_4
NetJ12_4: J12.4 ; port BTN_3
NetJ12_5: J12.5 ; port BTN_2
NetJ12_6: J12.6 ; port BTN_1

### Notes on the sheet
- POWER IN CONNECTOR
- BUTTON INPUT
- DEBUG CONNECTOR
- RADAR CAN-BUS CONNECTOR
- USB CONN
- RADAR RS232
- RADAR RS-422
- Proje/Project:
- Sayfa Adı/Document Name:
- Çizilme Tarihi/Drawing Date
- Umit KAYACIK
- Tasarlayan/Designed By
- Sayfa/Sheet:
- Revision:
- of
- Son Güncelleme/Last Edit Date
- Kontrol eden/Checked By
- Onaylayan/Approved By
- Boyut/Size:
- Varyant/Variant:
- Dil/Language:
- A3
- ENG

### Library data of the parts
J6 J10 = 43045-0627: Conn Wire to Board HDR 6 POS 3mm Solder ST Thru-Hole Micro-Fit 3.0™ Tray; Manufacturer: Molex; Current Rating: 5A; Voltage Rating: 250V; Contact Resistance: 10mR; Max Voltage Rating (DC): 250.25kV; Number of Positions: 6; Gender: Male; Glow Wire Compliant: Compliant; Supplier 1: Digikey; Manufacturer Part Number: 43045-0627; RoHS: Yes; Category: Headers and Wire Housings; Stock 1: 9980; Pricing 1: 1=1.19, 10=0.983, 80=0.81888, 1728=0.61417, 3456=0.5937 (USD); Mount: Through Hole; Contact Plating: Tin; Contact Material: Brass; Housing Material: Thermoplastic; Min Operating Temperature: -40°C; Max Operating Temperature: 105°C; Number of Rows: 2; Package Quantity: 1728; Packaging: Tray; Termination: Solder; Number of Contacts: 6; Orientation: Vertical; Number of Circuits: 6; Series: 43045; Pitch: 3mm; Row Spacing: 3mm; Reach SVHC Compliant: No; Halogen Free: Low Halogen; RoHS Compliant: Yes; Supplier Part Number 1: WM10673-ND
J7 J11 = MicroFit_2x2_VERT: Connector Header Through Hole 4 position 0.118" (3.00mm); Manufacturer: Molex; Manufacturer Part Number: 0430450427
J8 = B3B-PH-K-S_LF__SN_: Connector; Manufacturer_Name: JST (JAPAN SOLDERLESS TERMINALS); Datasheet Link: http://www.jst-mfg.com/product/pdf/eng/ePH.pdf; Height: 6mm; Manufacturer_Part_Number: B3B-PH-K-S(LF)(SN); LCSC Manufacturer Part Number: B3B-PH-K-S(LF)(SN); Arrow Part Number: B3B-PH-K-S(LF)(SN); Arrow Price/Stock: https://www.arrow.com/en/products/b3b-ph-k-s-lf-sn/jst-manufacturing; LCSC Part Number: C131339
J9 = 87520-0010BLF: USB 2.0, Input Output Connector, USB Type A, Standard, Right Angle, Through Hole, Single Decks, 4 Positions; Manufacturer: Amphenol ICC / FCI; Supplier 1: Digikey; Manufacturer Part Number: 87520-0010BLF; RoHS: No; Category: USB Connectors; Stock 1: 17622; Pricing 1: 1=0.95, 10=0.806, 42=0.7569, 84=0.72393, 252=0.65813, 504=0.5923, 1008=0.52649, 2520=0.47713 (USD); ComponentLink1URL: https://datasheet.octopart.com/87520-0010BLF-Areva-datasheet-144648.pdf?src-supplier=Digikey; ComponentLink1Description: https://datasheet.octopart.com/87520-0010BLF-Areva-datasheet-144648.pdf?src-supplier=Digikey; ComponentLink2URL: https://datasheet.octopart.com/87520-0010BLF-Areva-datasheet-154125.pdf?src-supplier=Mouser; ComponentLink2Description: https://datasheet.octopart.com/87520-0010BLF-Areva-datasheet-154125.pdf?src-supplier=Mouser; ComponentLink3URL: https://datasheet.octopart.com/87520-0010BLF-Amphenol-Communications-Solutions-datasheet-13707174.pdf?src-supplier=Farnell; ComponentLink3Description: https://datasheet.octopart.com/87520-0010BLF-Amphenol-Communications-Solutions-datasheet-13707174.pdf?src-supplier=Farnell; ComponentLink4URL: https://datasheet.octopart.com/87520-0010BLF-Areva-datasheet-21380287.pdf?src-supplier=Element14; ComponentLink4Description: https://datasheet.octopart.com/87520-0010BLF-Areva-datasheet-21380287.pdf?src-supplier=Element14; ComponentLink5URL: https://datasheet.octopart.com/87520-0010BLF-Areva-datasheet-10049120.pdf?src-supplier=Newark; ComponentLink5Description: https://datasheet.octopart.com/87520-0010BLF-Areva-datasheet-10049120.pdf?src-supplier=Newark; ComponentLink6URL: https://datasheet.octopart.com/87520-0010BLF-Amphenol-Communications-Solutions-datasheet-168215140.pdf?src-supplier=TME; ComponentLink6Description: https://datasheet.octopart.com/87520-0010BLF-Amphenol-Communications-Solutions-datasheet-168215140.pdf?src-supplier=TME; ComponentLink7URL: https://datasheet.octopart.com/87520-0010BLF-Amphenol-Communications-Solutions-datasheet-100449257.pdf?src-supplier=Electro+Sonic; ComponentLink7Description: https://datasheet.octopart.com/87520-0010BLF-Amphenol-Communications-Solutions-datasheet-100449257.pdf?src-supplier=Electro+Sonic; Supplier Part Number 1: 609-1045-ND
J12 = 43045-1227: Conn Power HDR 12 POS 3mm Solder ST Thru-Hole 12 Terminal 1 Port Micro-Fit 3.0™ Frame; Manufacturer: Molex; Current Rating: 5A; Voltage Rating: 600V; Number of Positions: 12; Gender: Male; Glow Wire Compliant: Compliant; Supplier 1: Digikey; Manufacturer Part Number: 43045-1227; RoHS: Yes; Category: Headers and Wire Housings; Stock 1: 5235; Pricing 1: 1=2.93, 10=2.578, 80=2.05088, 1008=1.69926, 3024=1.58207 (USD); Contact Plating: Tin; Contact Material: Brass; Housing Material: Thermoplastic; Number of Rows: 2; Packaging: Tray; Package Quantity: 1008; Termination: Through Hole; Number of Contacts: 12; Orientation: Vertical; Number of Circuits: 12; Series: 43045; Pitch: 3mm; Row Spacing: 3mm; Halogen Free: Low Halogen; RoHS Compliant: Yes; ComponentLink1URL: https://datasheet.ciiva.com/13676/0430451227-pcb-headers-143012-13676689.pdf?src-supplier=Mouser; ComponentLink1Description: https://datasheet.ciiva.com/13676/0430451227-pcb-headers-143012-13676689.pdf?src-supplier=Mouser; ComponentLink2URL: https://datasheet.ciiva.com/7814/1629779-7814795.pdf?src-supplier=Element14; ComponentLink2Description: https://datasheet.ciiva.com/7814/1629779-7814795.pdf?src-supplier=Element14; Supplier Part Number 1: WM10697-ND